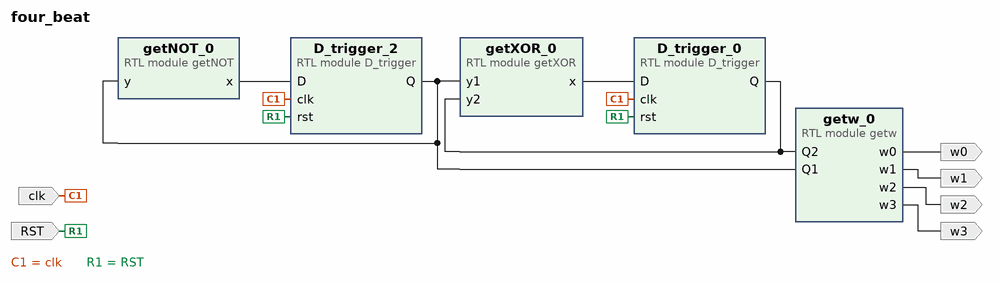
[diagram p0: block diagram of the top level]
# Vivado block design four_beat, xc7a35tcsg324-1, Vivado 2020.1
create_bd_design four_beat

create_bd_port -dir I -type clk clk
set_property -dict {CONFIG.FREQ_HZ 10000000} [get_bd_ports clk]
create_bd_port -dir I -type rst RST
set_property -dict {CONFIG.POLARITY ACTIVE_HIGH} [get_bd_ports RST]
create_bd_port -dir O w0
create_bd_port -dir O w1
create_bd_port -dir O w2
create_bd_port -dir O w3

create_bd_cell -type module -reference getXOR getXOR_0
create_bd_cell -type module -reference getNOT getNOT_0
create_bd_cell -type module -reference getw getw_0
create_bd_cell -type module -reference D_trigger D_trigger_0
create_bd_cell -type module -reference D_trigger D_trigger_2

# ---- connections ----

connect_bd_net [get_bd_pins getw_0/w0] [get_bd_ports w0]
connect_bd_net [get_bd_pins getw_0/w1] [get_bd_ports w1]
connect_bd_net [get_bd_pins getw_0/w2] [get_bd_ports w2]
connect_bd_net [get_bd_pins getw_0/w3] [get_bd_ports w3]
connect_bd_net [get_bd_ports clk] [get_bd_pins D_trigger_0/clk] [get_bd_pins D_trigger_2/clk]
connect_bd_net [get_bd_pins getNOT_0/x] [get_bd_pins D_trigger_2/D]
connect_bd_net [get_bd_pins getXOR_0/x] [get_bd_pins D_trigger_0/D]
connect_bd_net [get_bd_ports RST] [get_bd_pins D_trigger_0/rst] [get_bd_pins D_trigger_2/rst]
connect_bd_net [get_bd_pins D_trigger_2/Q] [get_bd_pins getXOR_0/y1] [get_bd_pins getNOT_0/y] [get_bd_pins getw_0/Q1]
connect_bd_net [get_bd_pins D_trigger_0/Q] [get_bd_pins getXOR_0/y2] [get_bd_pins getw_0/Q2]

validate_bd_design
save_bd_design
